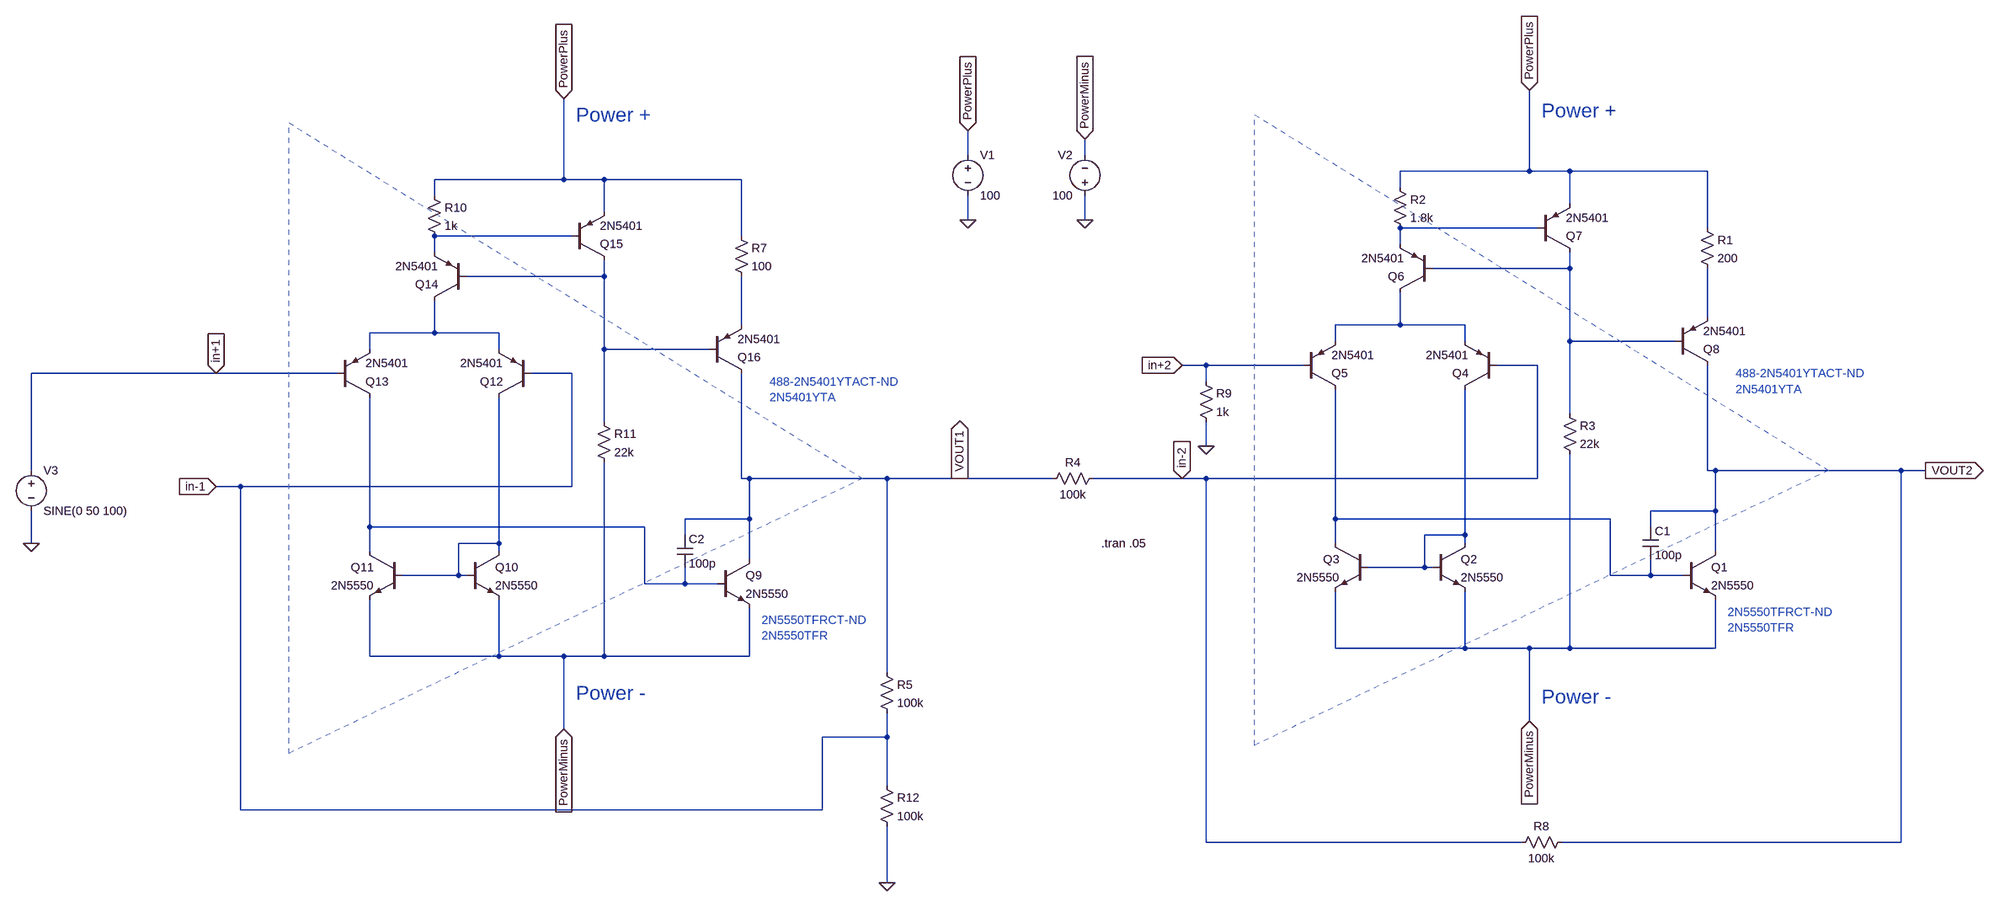
[diagram p0: schematic BJTopamp.asc]
BJTopamp.asc, the LTspice schematic file:
Version 4
SHEET 1 1652 1152
WIRE -496 -304 -496 -352
WIRE -224 -304 -224 -336
WIRE 656 -272 656 -432
WIRE 656 -272 400 -272
WIRE 736 -272 656 -272
WIRE 1008 -272 736 -272
WIRE -1296 -256 -1296 -416
WIRE -1296 -256 -1552 -256
WIRE -1216 -256 -1296 -256
WIRE -944 -256 -1216 -256
WIRE 400 -240 400 -272
WIRE -1552 -224 -1552 -256
WIRE 736 -208 736 -272
WIRE -1216 -192 -1216 -256
WIRE -496 -176 -496 -224
WIRE -224 -176 -224 -224
WIRE 672 -160 400 -160
WIRE 1008 -160 1008 -272
WIRE -1280 -144 -1552 -144
WIRE -944 -144 -944 -256
WIRE 400 -128 400 -160
WIRE -1552 -112 -1552 -144
WIRE 736 -80 736 -112
WIRE 736 -80 464 -80
WIRE -1216 -64 -1216 -96
WIRE -1216 -64 -1488 -64
WIRE 1008 16 1008 -80
WIRE -944 32 -944 -64
WIRE 400 32 400 -32
WIRE 400 32 272 32
WIRE 528 32 400 32
WIRE -1552 48 -1552 -16
WIRE -1552 48 -1680 48
WIRE -1424 48 -1552 48
WIRE 272 64 272 32
WIRE 528 64 528 32
WIRE 736 64 736 -80
WIRE 944 64 736 64
WIRE -1680 80 -1680 48
WIRE -1424 80 -1424 48
WIRE -1216 80 -1216 -64
WIRE -1008 80 -1216 80
WIRE 16 112 -32 112
WIRE 208 112 16 112
WIRE 672 112 592 112
WIRE -1984 128 -2400 128
WIRE -1744 128 -1984 128
WIRE -1280 128 -1360 128
WIRE 16 144 16 112
WIRE 736 208 736 64
WIRE -1216 224 -1216 80
WIRE 16 272 16 224
WIRE -2400 320 -2400 128
WIRE 1008 320 1008 112
WIRE 1024 320 1008 320
WIRE 1392 320 1024 320
WIRE 1440 320 1392 320
WIRE -944 336 -944 128
WIRE -928 336 -944 336
WIRE -656 336 -928 336
WIRE -512 336 -656 336
WIRE -288 336 -512 336
WIRE -32 336 -208 336
WIRE 16 336 -32 336
WIRE 672 336 672 112
WIRE 672 336 16 336
WIRE -1936 352 -1984 352
WIRE -1280 352 -1280 128
WIRE -1280 352 -1936 352
WIRE 1024 400 1024 320
WIRE 1024 400 896 400
WIRE -928 416 -928 336
WIRE -928 416 -1056 416
WIRE 272 416 272 160
WIRE 816 416 272 416
WIRE -1680 432 -1680 176
WIRE -1136 432 -1680 432
WIRE 896 432 896 400
WIRE -1056 448 -1056 416
WIRE 528 448 528 160
WIRE 528 448 448 448
WIRE -2400 464 -2400 400
WIRE -1424 464 -1424 176
WIRE -1424 464 -1504 464
WIRE 272 464 272 416
WIRE 528 464 528 448
WIRE -1680 480 -1680 432
WIRE -1424 480 -1424 464
WIRE 1024 480 1024 400
WIRE -928 496 -928 416
WIRE 448 512 448 448
WIRE 448 512 336 512
WIRE 464 512 448 512
WIRE -1504 528 -1504 464
WIRE -1504 528 -1616 528
WIRE -1488 528 -1504 528
WIRE 816 528 816 416
WIRE 896 528 896 496
WIRE 896 528 816 528
WIRE 960 528 896 528
WIRE -1136 544 -1136 432
WIRE -1056 544 -1056 512
WIRE -1056 544 -1136 544
WIRE -992 544 -1056 544
WIRE 272 672 272 560
WIRE 528 672 528 560
WIRE 528 672 272 672
WIRE 656 672 528 672
WIRE 736 672 736 288
WIRE 736 672 656 672
WIRE 1024 672 1024 576
WIRE 1024 672 736 672
WIRE -1680 688 -1680 576
WIRE -1424 688 -1424 576
WIRE -1424 688 -1680 688
WIRE -1296 688 -1424 688
WIRE -1216 688 -1216 304
WIRE -1216 688 -1296 688
WIRE -928 688 -928 592
WIRE -928 688 -1216 688
WIRE -656 720 -656 336
WIRE 656 816 656 672
WIRE -1296 832 -1296 688
WIRE -656 848 -656 800
WIRE -656 848 -784 848
WIRE -656 944 -656 848
WIRE -1936 992 -1936 352
WIRE -784 992 -784 848
WIRE -784 992 -1936 992
WIRE 16 1056 16 336
WIRE 640 1056 16 1056
WIRE 1392 1056 1392 320
WIRE 1392 1056 720 1056
WIRE -656 1136 -656 1024
FLAG -496 -176 0
FLAG -224 -176 0
FLAG 1440 320 VOUT2
IOPIN 1440 320 Out
FLAG -32 336 in-2
IOPIN -32 336 In
FLAG -32 112 in+2
IOPIN -32 112 In
FLAG -2400 464 0
FLAG 16 272 0
FLAG -512 336 VOUT1
IOPIN -512 336 Out
FLAG -1984 352 in-1
IOPIN -1984 352 In
FLAG -1984 128 in+1
IOPIN -1984 128 In
FLAG -1296 -416 PowerPlus
IOPIN -1296 -416 In
FLAG 656 -432 PowerPlus
IOPIN 656 -432 In
FLAG -1296 832 PowerMinus
IOPIN -1296 832 In
FLAG 656 816 PowerMinus
IOPIN 656 816 In
FLAG -224 -336 PowerMinus
IOPIN -224 -336 In
FLAG -496 -352 PowerPlus
IOPIN -496 -352 In
FLAG -656 1136 0
SYMBOL voltage -496 -320 R0
WINDOW 123 0 0 Left 0
WINDOW 39 0 0 Left 0
SYMATTR InstName V1
SYMATTR Value 100
SYMBOL voltage -224 -208 R180
WINDOW 0 24 96 Left 2
WINDOW 3 24 16 Left 2
WINDOW 123 0 0 Left 0
WINDOW 39 0 0 Left 0
SYMATTR InstName V2
SYMATTR Value 100
SYMBOL voltage -2400 304 R0
WINDOW 123 0 0 Left 0
WINDOW 39 0 0 Left 0
SYMATTR InstName V3
SYMATTR Value SINE(0 50 100)
SYMBOL res 736 1040 R90
WINDOW 0 0 56 VBottom 2
WINDOW 3 32 56 VTop 2
SYMATTR InstName R8
SYMATTR Value 100k
SYMBOL res 0 128 R0
SYMATTR InstName R9
SYMATTR Value 1k
SYMBOL res 992 -176 R0
SYMATTR InstName R1
SYMATTR Value 200
SYMBOL npn 960 480 R0
SYMATTR InstName Q1
SYMATTR Value 2N5550
SYMBOL npn 464 464 R0
SYMATTR InstName Q2
SYMATTR Value 2N5550
SYMBOL npn 336 464 M0
SYMATTR InstName Q3
SYMATTR Value 2N5550
SYMBOL pnp 592 160 R180
SYMATTR InstName Q4
SYMATTR Value 2N5401
SYMBOL pnp 208 160 M180
SYMATTR InstName Q5
SYMATTR Value 2N5401
SYMBOL pnp 464 -32 R180
SYMATTR InstName Q6
SYMATTR Value 2N5401
SYMBOL pnp 672 -112 M180
SYMATTR InstName Q7
SYMATTR Value 2N5401
SYMBOL res 384 -256 R0
SYMATTR InstName R2
SYMATTR Value 1.8k
SYMBOL cap 880 432 R0
SYMATTR InstName C1
SYMATTR Value 100p
SYMBOL pnp 944 112 M180
SYMATTR InstName Q8
SYMATTR Value 2N5401
SYMBOL res 720 192 R0
SYMATTR InstName R3
SYMATTR Value 22k
SYMBOL res -192 320 R90
WINDOW 0 0 56 VBottom 2
WINDOW 3 32 56 VTop 2
SYMATTR InstName R4
SYMATTR Value 100k
SYMBOL res -960 -160 R0
SYMATTR InstName R7
SYMATTR Value 100
SYMBOL npn -992 496 R0
SYMATTR InstName Q9
SYMATTR Value 2N5550
SYMBOL npn -1488 480 R0
SYMATTR InstName Q10
SYMATTR Value 2N5550
SYMBOL npn -1616 480 M0
SYMATTR InstName Q11
SYMATTR Value 2N5550
SYMBOL pnp -1360 176 R180
SYMATTR InstName Q12
SYMATTR Value 2N5401
SYMBOL pnp -1744 176 M180
SYMATTR InstName Q13
SYMATTR Value 2N5401
SYMBOL pnp -1488 -16 R180
SYMATTR InstName Q14
SYMATTR Value 2N5401
SYMBOL pnp -1280 -96 M180
SYMATTR InstName Q15
SYMATTR Value 2N5401
SYMBOL res -1568 -240 R0
SYMATTR InstName R10
SYMATTR Value 1k
SYMBOL cap -1072 448 R0
SYMATTR InstName C2
SYMATTR Value 100p
SYMBOL pnp -1008 128 M180
SYMATTR InstName Q16
SYMATTR Value 2N5401
SYMBOL res -1232 208 R0
SYMATTR InstName R11
SYMATTR Value 22k
SYMBOL res -672 704 R0
SYMATTR InstName R5
SYMATTR Value 100k
SYMBOL res -672 928 R0
SYMATTR InstName R12
SYMATTR Value 100k
TEXT -192 464 Left 2 !.tran .05
TEXT 680 768 Left 4 ;Power -
TEXT 680 -392 Left 4 ;Power +
TEXT 1048 600 Left 2 ;2N5550TFRCT-ND\n2N5550TFR
TEXT 1064 128 Left 2 ;488-2N5401YTACT-ND\n2N5401YTA
TEXT -1272 760 Left 4 ;Power -
TEXT -1272 -384 Left 4 ;Power +
TEXT -904 616 Left 2 ;2N5550TFRCT-ND\n2N5550TFR
TEXT -888 144 Left 2 ;488-2N5401YTACT-ND\n2N5401YTA
LINE Normal 112 864 112 -384 2
LINE Normal 1248 320 112 864 2
LINE Normal 112 -384 1248 320 2
LINE Normal -1840 880 -1840 -368 2
LINE Normal -704 336 -1840 880 2
LINE Normal -1840 -368 -704 336 2

The netlist it stands for:
* BJTopamp.asc
V1 PowerPlus 0 100
V2 0 PowerMinus 100
V3 in+1 0 SINE(0 50 100)
R8 VOUT2 in-2 100k
R9 in+2 0 1k
R1 PowerPlus N005 200
Q1 VOUT2 N009 PowerMinus 0 2N5550
Q2 N011 N011 PowerMinus 0 2N5550
Q3 N009 N011 PowerMinus 0 2N5550
Q4 N011 in-2 N007 0 2N5401
Q5 N009 in+2 N007 0 2N5401
Q6 N007 N003 N001 0 2N5401
Q7 N003 N001 PowerPlus 0 2N5401
R2 PowerPlus N001 1.8k
C1 VOUT2 N009 100p
Q8 VOUT2 N003 N005 0 2N5401
R3 N003 PowerMinus 22k
R4 in-2 VOUT1 100k
R7 PowerPlus N006 100
Q9 VOUT1 N010 PowerMinus 0 2N5550
Q10 N012 N012 PowerMinus 0 2N5550
Q11 N010 N012 PowerMinus 0 2N5550
Q12 N012 in-1 N008 0 2N5401
Q13 N010 in+1 N008 0 2N5401
Q14 N008 N004 N002 0 2N5401
Q15 N004 N002 PowerPlus 0 2N5401
R10 PowerPlus N002 1k
C2 VOUT1 N010 100p
Q16 VOUT1 N004 N006 0 2N5401
R11 N004 PowerMinus 22k
R5 VOUT1 in-1 100k
R12 in-1 0 100k
.model NPN NPN
.model PNP PNP
.lib standard.bjt
.tran .05
* Power -
* Power +
* 2N5550TFRCT-ND
* 2N5550TFR
* 488-2N5401YTACT-ND
* 2N5401YTA
* Power -
* Power +
* 2N5550TFRCT-ND
* 2N5550TFR
* 488-2N5401YTACT-ND
* 2N5401YTA
.backanno
.end